# Altium schematic sheet outputs.SchDoc
size B; SheetNumber: 1; SheetTotal: 3
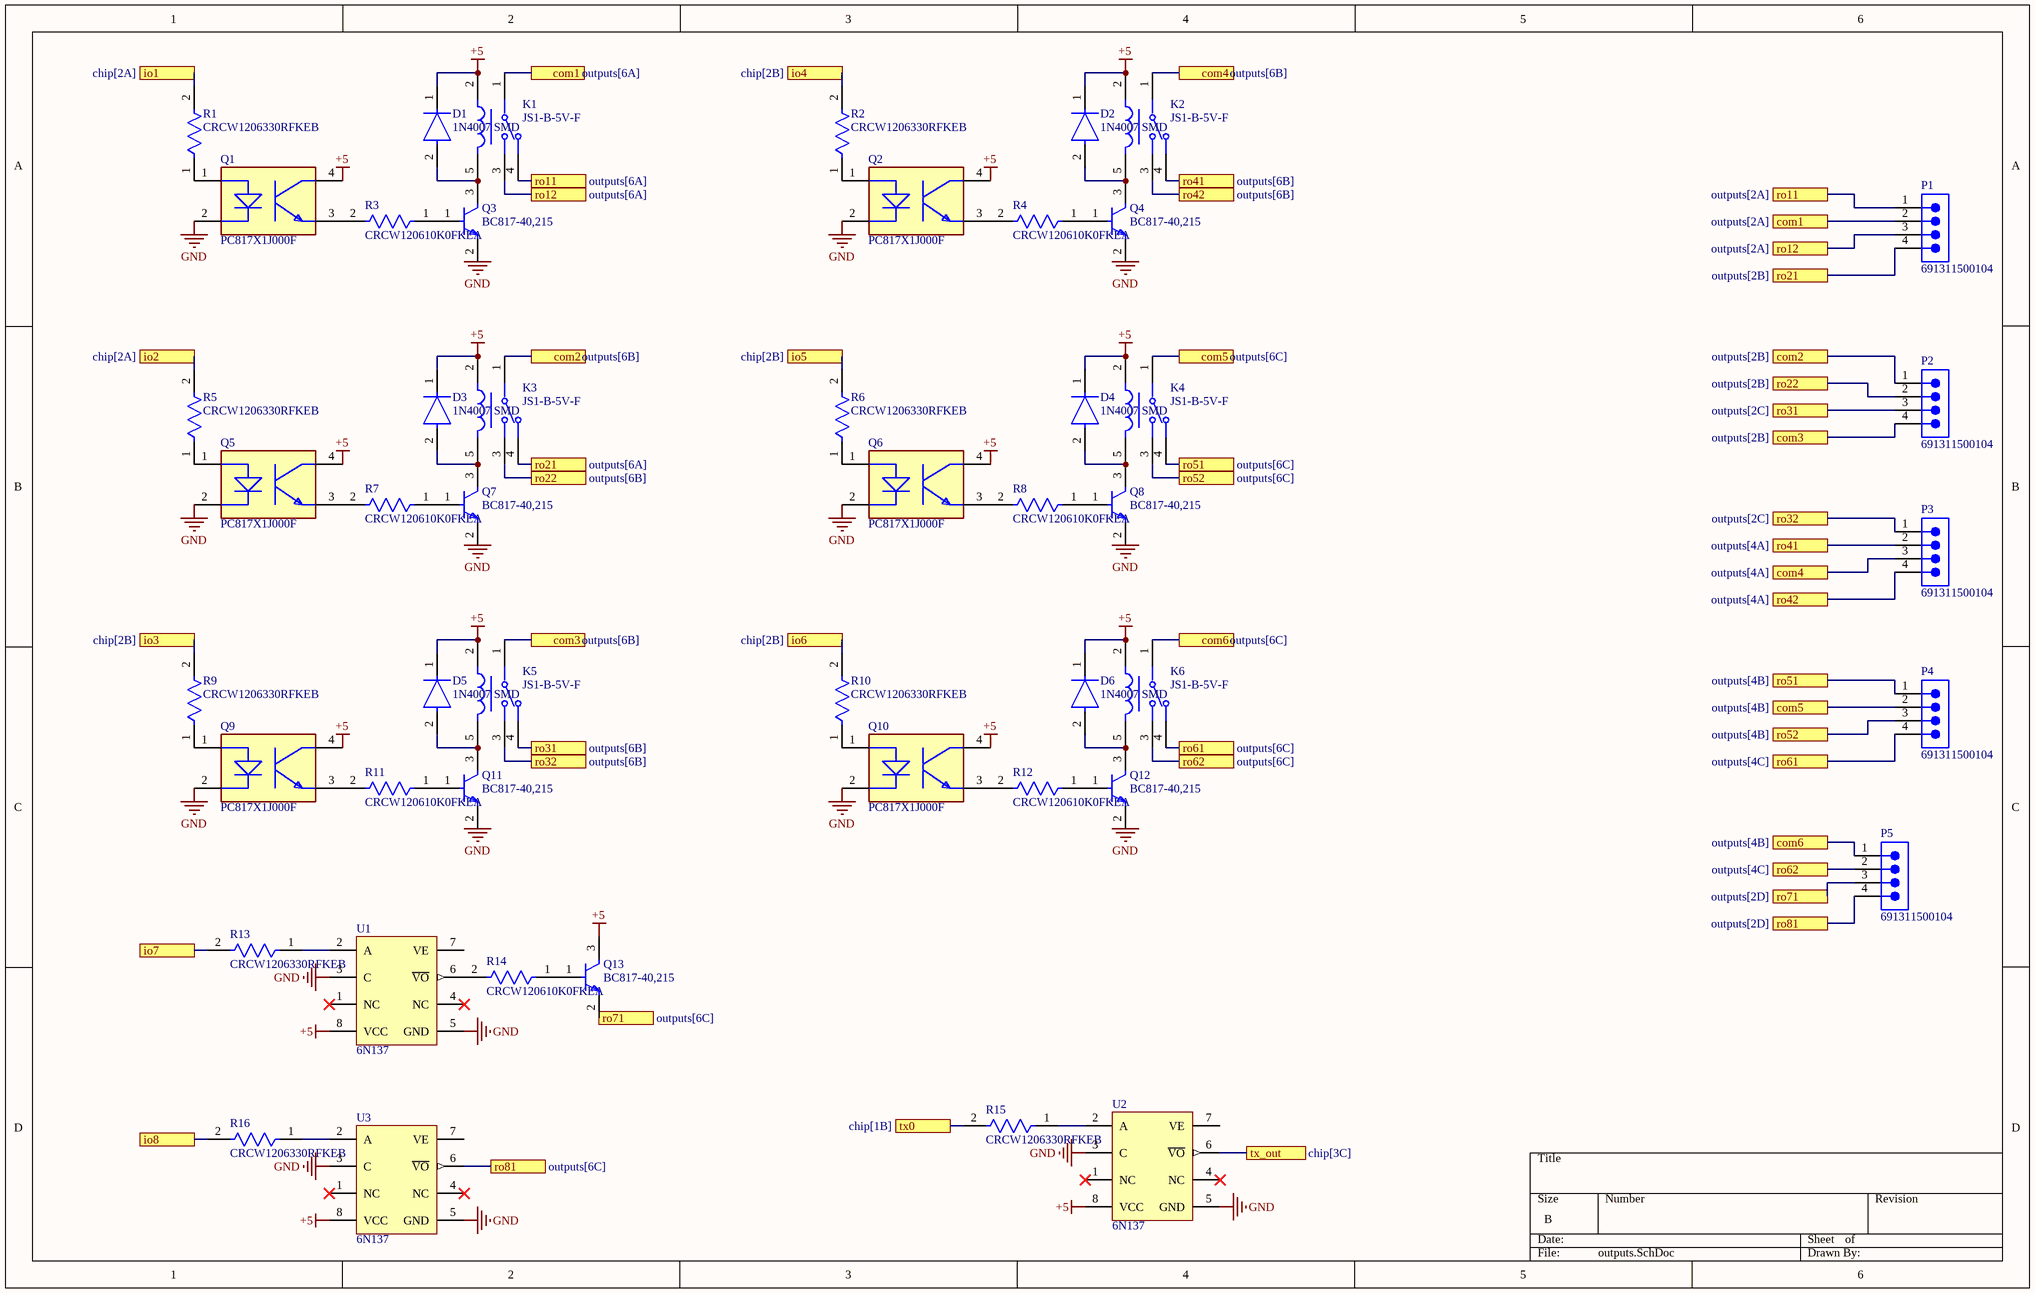
[diagram p0: outputs.SchDoc]

## Parts
D1  1N4007 SMD  [FP-1N4007_SMD-IPC_C]
D2  1N4007 SMD  [FP-1N4007_SMD-IPC_C]
D3  1N4007 SMD  [FP-1N4007_SMD-IPC_C]
D4  1N4007 SMD  [FP-1N4007_SMD-IPC_C]
D5  1N4007 SMD  [FP-1N4007_SMD-IPC_C]
D6  1N4007 SMD  [FP-1N4007_SMD-IPC_C]
K1  JS1-B-5V-F  [FP-JS1-B-5V-F-MFG]
K2  JS1-B-5V-F  [FP-JS1-B-5V-F-MFG]
K3  JS1-B-5V-F  [FP-JS1-B-5V-F-MFG]
K4  JS1-B-5V-F  [FP-JS1-B-5V-F-MFG]
K5  JS1-B-5V-F  [FP-JS1-B-5V-F-MFG]
K6  JS1-B-5V-F  [FP-JS1-B-5V-F-MFG]
P1  691311500104  [691311500104]
P2  691311500104  [691311500104]
P3  691311500104  [691311500104]
P4  691311500104  [691311500104]
P5  691311500104  [691311500104]
Q1  PC817X1J000F  [FP-PC817X1J000F-MFG]
Q2  PC817X1J000F  [FP-PC817X1J000F-MFG]
Q3  BC817-40,215  [FP-SOT23-MFG]
Q4  BC817-40,215  [FP-SOT23-MFG]
Q5  PC817X1J000F  [FP-PC817X1J000F-MFG]
Q6  PC817X1J000F  [FP-PC817X1J000F-MFG]
Q7  BC817-40,215  [FP-SOT23-MFG]
Q8  BC817-40,215  [FP-SOT23-MFG]
Q9  PC817X1J000F  [FP-PC817X1J000F-MFG]
Q10  PC817X1J000F  [FP-PC817X1J000F-MFG]
Q11  BC817-40,215  [FP-SOT23-MFG]
Q12  BC817-40,215  [FP-SOT23-MFG]
Q13  BC817-40,215  [FP-SOT23-MFG]
R1  CRCW1206330RFKEB  [FP-CRCW1206-e3-IPC_A]
R2  CRCW1206330RFKEB  [FP-CRCW1206-e3-IPC_A]
R3  CRCW120610K0FKEA  [FP-CRCW1206-e3-IPC_C]
R4  CRCW120610K0FKEA  [FP-CRCW1206-e3-IPC_C]
R5  CRCW1206330RFKEB  [FP-CRCW1206-e3-IPC_A]
R6  CRCW1206330RFKEB  [FP-CRCW1206-e3-IPC_A]
R7  CRCW120610K0FKEA  [FP-CRCW1206-e3-IPC_C]
R8  CRCW120610K0FKEA  [FP-CRCW1206-e3-IPC_C]
R9  CRCW1206330RFKEB  [FP-CRCW1206-e3-IPC_A]
R10  CRCW1206330RFKEB  [FP-CRCW1206-e3-IPC_A]
R11  CRCW120610K0FKEA  [FP-CRCW1206-e3-IPC_C]
R12  CRCW120610K0FKEA  [FP-CRCW1206-e3-IPC_C]
R13  CRCW1206330RFKEB  [FP-CRCW1206-e3-IPC_A]
R14  CRCW120610K0FKEA  [FP-CRCW1206-e3-IPC_C]
R15  CRCW1206330RFKEB  [FP-CRCW1206-e3-IPC_A]
R16  CRCW1206330RFKEB  [FP-CRCW1206-e3-IPC_A]
U1  6N137  [VISH-DIP-8_A]
U2  6N137  [VISH-DIP-8_A]
U3  6N137  [VISH-DIP-8_A]

## Ports
com1 (see outputs[2A]), com1 (see outputs[6A]), com2 (see outputs[2B]), com2 (see outputs[6B]), com3 (see outputs[2B]), com3 (see outputs[6B]), com4 (see outputs[4A]), com4 (see outputs[6B]), com5 (see outputs[4B]), com5 (see outputs[6C]), com6 (see outputs[4B]), com6 (see outputs[6C]), io1 (see chip[2A]), io2 (see chip[2A]), io3 (see chip[2B]), io4 (see chip[2B]), io5 (see chip[2B]), io6 (see chip[2B]), io7, io8, ro11 (see outputs[2A]), ro11 (see outputs[6A]), ro12 (see outputs[2A]), ro12 (see outputs[6A]), ro21 (see outputs[2B]), ro21 (see outputs[6A]), ro22 (see outputs[2B]), ro22 (see outputs[6B]), ro31 (see outputs[2C]), ro31 (see outputs[6B]), ro32 (see outputs[2C]), ro32 (see outputs[6B]), ro41 (see outputs[4A]), ro41 (see outputs[6B]), ro42 (see outputs[4A]), ro42 (see outputs[6B]), ro51 (see outputs[4B]), ro51 (see outputs[6C]), ro52 (see outputs[4B]), ro52 (see outputs[6C]), ro61 (see outputs[4C]), ro61 (see outputs[6C]), ro62 (see outputs[4C]), ro62 (see outputs[6C]), ro71 (see outputs[2D]), ro71 (see outputs[6C]), ro81 (see outputs[2D]), ro81 (see outputs[6C]), tx0 (see chip[1B]), tx_out (see chip[3C])

## Nets
+5: D1.1(C) D2.1(C) D3.1(C) D4.1(C) D5.1(C) D6.1(C) K1.2 K2.2 K3.2 K4.2 K5.2 K6.2 Q1.4(C) Q2.4(C) Q5.4(C) Q6.4(C) Q9.4(C) Q10.4(C) Q13.3(C) U1.8(VCC) U2.8(VCC) U3.8(VCC)
GND: Q1.2(C) Q2.2(C) Q3.2(E) Q4.2(E) Q5.2(C) Q6.2(C) Q7.2(E) Q8.2(E) Q9.2(C) Q10.2(C) Q11.2(E) Q12.2(E) U1.3(C) U1.5(GND) U2.3(C) U2.5(GND) U3.3(C) U3.5(GND)
com1: K1.1(COM) P1.2 ; port com1
com2: K3.1(COM) P2.1 ; port com2
com3: K5.1(COM) P2.4 ; port com3
com4: K2.1(COM) P3.3 ; port com4
com5: K4.1(COM) P4.2 ; port com5
com6: K6.1(COM) P5.1 ; port com6
io1: R1.2 ; port io1
io2: R5.2 ; port io2
io3: R9.2 ; port io3
io4: R2.2 ; port io4
io5: R6.2 ; port io5
io6: R10.2 ; port io6
io7: R13.2 ; port io7
io8: R16.2 ; port io8
ro11: K1.4(NC) P1.1 ; port ro11
ro12: K1.3(NO) P1.3 ; port ro12
ro21: K3.4(NC) P1.4 ; port ro21
ro22: K3.3(NO) P2.2 ; port ro22
ro31: K5.4(NC) P2.3 ; port ro31
ro32: K5.3(NO) P3.1 ; port ro32
ro41: K2.4(NC) P3.2 ; port ro41
ro42: K2.3(NO) P3.4 ; port ro42
ro51: K4.4(NC) P4.1 ; port ro51
ro52: K4.3(NO) P4.3 ; port ro52
ro61: K6.4(NC) P4.4 ; port ro61
ro62: K6.3(NO) P5.2 ; port ro62
ro71: P5.3 Q13.2(E) ; port ro71
ro81: P5.4 U3.6(~{VO}) ; port ro81
tx0: R15.2 ; port tx0
tx_out: U2.6(~{VO}) ; port tx_out
NetD1_2: D1.2(A) K1.5 Q3.3(C)
NetD2_2: D2.2(A) K2.5 Q4.3(C)
NetD3_2: D3.2(A) K3.5 Q7.3(C)
NetD4_2: D4.2(A) K4.5 Q8.3(C)
NetD5_2: D5.2(A) K5.5 Q11.3(C)
NetD6_2: D6.2(A) K6.5 Q12.3(C)
NetQ1_1: Q1.1(A) R1.1
NetQ1_3: Q1.3(E) R3.2
NetQ2_1: Q2.1(A) R2.1
NetQ2_3: Q2.3(E) R4.2
NetQ3_1: Q3.1(B) R3.1
NetQ4_1: Q4.1(B) R4.1
NetQ5_1: Q5.1(A) R5.1
NetQ5_3: Q5.3(E) R7.2
NetQ6_1: Q6.1(A) R6.1
NetQ6_3: Q6.3(E) R8.2
NetQ7_1: Q7.1(B) R7.1
NetQ8_1: Q8.1(B) R8.1
NetQ9_1: Q9.1(A) R9.1
NetQ9_3: Q9.3(E) R11.2
NetQ10_1: Q10.1(A) R10.1
NetQ10_3: Q10.3(E) R12.2
NetQ11_1: Q11.1(B) R11.1
NetQ12_1: Q12.1(B) R12.1
NetQ13_1: Q13.1(B) R14.1
NetR13_1: R13.1 U1.2(A)
NetR14_2: R14.2 U1.6(~{VO})
NetR15_1: R15.1 U2.2(A)
NetR16_1: R16.1 U3.2(A)

Not connected (* = marked no-connect by the designer): U1 1(NC)* 4(NC)* 7(VE); U2 1(NC)* 4(NC)* 7(VE); U3 1(NC)* 4(NC)* 7(VE)

## Library data of the parts
D1-D6 = CMP-12389-000001-1: Rectifier, 1Kv, 1A, Do-214Ac Rohs Compliant: Yes
K1-K6 = CMP-00287-00689748-1: JS1-B-5V-F Electromechanical Relay 5VDC 69.4Ohm 5ADC/10AAC SPDT (22x16x16.4)mm THT Power Relay; NexarPartId: 689748; Coil Voltage (DC): 5V; Coil Resistance: 69.4Ω; Coil Power: 360mW; Voltage Rating (AC): 250V; Number of Contacts: 1; Coil Type: Non-Latching; Current Rating: 10A; Coil Current: 72mA; Operate Time: 10ms; Max Voltage Rating (DC): 100V; Relay Type: General Purpose; Throw Configuration: SPDT; Depth: 16mm; Lead Free: Lead Free; Contact Material: Silver, Tin; Max Operating Temperature: 85°C; Number of Pins: 5; Mount: Through Hole; Ambient Temperature Range High: 85°C; Height: 16mm; Weight: 12g; Power Consumption: 360mW; REACH SVHC: No SVHC; Min Operating Temperature: -40°C; Termination: PC Pin; Width: 22mm; Max Current Rating: 10A; Packaging: Bulk; Length: 22mm; Switching Current: 10A; Power Rating: 360mW; RoHS: Compliant; Max Voltage Rating (AC): 250V; Release Time: 10ms; Contact Current Rating: 10A
P1-P5 = CMP-1502-02148-2: NexarPartId: 8917749; Pitch: 5.08mm; Number of Positions Per Level: 4; Gender: Male; Voltage: 300V; Current: 20A; Number of Levels: 1; Orientation: Vertical; Number of Pins: 4; Mount: Through Hole; Number of Contacts: 4; Length: 8.5mm; Number of Rows: 1; Contact Plating: Tin; Color: Green; Termination: Solder; Contact Material: Brass; REACH SVHC: Unknown; RoHS: Compliant; Lead Pitch: 5.08mm; Width: 22.32mm; Height: 12mm; Packaging: Box
Q1 Q2 Q5 Q6 Q9 Q10 = CMP-65434-000003-1: OPTOISOLATOR 5KV TRANS 4DIP; Collector Emitter Saturation Voltage: 200mV; Forward Voltage: 1.4V; Power Dissipation: 200mW; Input Current: 20mA; Max Collector Current: 50mA; Collector Emitter Breakdown Voltage: 80V; Rise Time: 18000ns; Number of Elements: 1; Reverse Breakdown Voltage: 6V; Current Transfer Ratio: 600%; Min Operating Temperature: -30°C; Number of Pins: 4; Radiation Hardening: No; Output Current per Channel: 50mA; Case/Package: DIP; Fall Time: 18000ns; Forward Current: 50mA; Isolation Voltage: 5kV; Package Quantity: 2000; Max Operating Temperature: 100°C; Packaging: Sleeve; Max Input Current: 50mA; Output Voltage: 80V; Max Power Dissipation: 200mW; Mount: Through Hole; Number of Channels: 1; Collector Emitter Voltage (VCEO): 80V
Q3 Q4 Q7 Q8 Q11-Q13 = CMP-14406-000007-1: TRANS NPN 45V 0.5A SOT23; Manufacturer: Nexperia; Collector Emitter Saturation Voltage: 700mV; Power Dissipation: 250mW; Collector Base Voltage: 50V; Unity Gain Freq: 100MHz; Hfe Max: 600; Rthja Max: 500K/W; Emitter Base Voltage: 5V; Max Collector Current: 500mA; Hfe Testvce: 1V; Automotive Grade: Grade 0; Hfe Min: 250; Max Junction Temp: +150°C; Number Of Npn: 1; Hfe Testic: 100mA; Octopart: https://octopart.com/bc817-40%2C215-nexperia-78739081; Lead Free: Yes; Ipc Land Pattern Name: SOT95P230X100-3; Manufacturer Part Number: BC817-40,215; RoHS: TRUE; Collector Emitter Breakdown Voltage: 45V; Digikey Description: TRANS NPN 45V 0.5A SOT23; ComponentLink2URL: https://assets.nexperia.com/documents/data-sheet/BC817_SER.pdf; Temperature Range High: +150°C; Mouser Description: BC817 Series 45 V 500 mA 250 mW SMT NPN General-Purpose Transistor - SOT-23-; Device Class L3: BJTs; Temperature: to +150°C; Height: 1.1mm; Automotive: Yes; Ambient Temperature Range Low: -65°C; Package: SOT23; Collector Emitter Voltage: 45V; Category: Trans; ComponentLink2Description: Datasheet; Device Class L2: Transistors; Ambient Temperature Range High: +150°C; Number Of Elements: 1; Device Class L1: Discrete Semiconductors; Footprint Url: https://assets.nexperia.com/documents/outline-drawing/SOT23.pdf
R1 R2 R5 R6 R9 R10 R13 R15 R16 = CMP-02407-010853-1: RES Thick Film, 330Ω, 1%, 0.25W, 100ppm/°C, 1206; Resistance: 330R; Power Rating: 250mW; Voltage Rating: 200V; Package Quantity: 10000; Width: 0.063inch; Length: 0.126inch; Case/Package: 1206; Lead Free: Lead Free; Max Operating Temperature: 155°C; Height: 0.024inch; Case Code (Imperial): 1206; Weight: 0.000353oz; Max Power Dissipation: 250mW; Packaging: Tape and Reel; Case Code (Metric): 3216; Number of Terminations: 2; Min Operating Temperature: -55°C; Features: Automotive AEC-Q200; Tolerance: 1%; Composition: Thick Film; Temperature Coefficient: 100ppm/°C
R3 R4 R7 R8 R11 R12 R14 = CMP-2003-04807-2: RES Thick Film, 10kΩ, 1%, 0.25W, 100ppm/°C, 1206; Working Voltage: 200V; Max Power Dissipation: 250mW; Resistance: 10kR; Tolerance: 1%; Width: 0.063inch; Height: 0.55mm; Number of Pins: 2; Voltage Rating: 200V; Temperature Coefficient: 100ppm/°C; Military Standard: Not; Features: Automotive AEC-Q200; Depth: 1.6mm; Radiation Hardening: No; Termination: SMD/SMT; Case Code (Imperial): 1206; Weight: 0.000353oz; Length: 3.2mm; Package Quantity: 10; Voltage Rating (DC): 200V; Case/Package: 1206; Min Operating Temperature: -55°C; Number of Terminations: 2; Composition: Thick Film; Contact Plating: Tin; Power Rating: 250mW; Packaging: Tape and Reel; Max Operating Temperature: 155°C; Lead Free: Lead Free; Case Code (Metric): 3216
U1-U3 = CMP-2000-05669-1: High Speed Optocoupler, Single and Dual, 10 MBd, 5 V, -40 to 100 degC, 8-Pin DIP, RoHS, Tube; Manufacturer: Vishay; No. of Channels: 1Channel; Isolation Voltage: 5.3kV; Data Rate: 10Mbaud; SVHC: ToBeAdvised; No. of Pins: 8Pins; Package Description: 8-Pin Double In-line Package, Body 10.16 x 6.7 mm, Pitch 2.54 mm; Manufacturer URL: http://www.vishay.com/; Product Range: -; Optocoupler Case Style: DIP; Mounting Technology: ThroughHole; Packaging: Each; Package Reference: DIP-8; Datasheet Version: Rev. 1.9, 03/2015; Datasheet URL: http://www.vishay.com/docs/84732/6n137.pdf